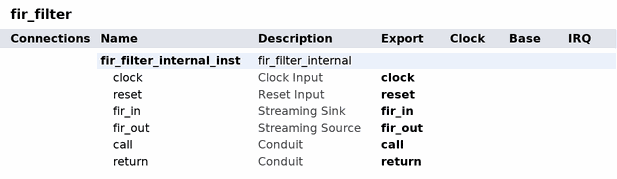
[diagram p0: system contents]
# Platform Designer (Qsys) system fir_filter, MAX 10 10M50DAF672I7G
# Parameters at their usual value, and those the tool derives, are not listed.
package require qsys
create_system fir_filter
set_project_property DEVICE_FAMILY {MAX 10}
set_project_property DEVICE 10M50DAF672I7G

add_instance fir_filter_internal_inst fir_filter_internal 1.0
set_instance_property fir_filter_internal_inst AUTO_EXPORT true

# exported interfaces
add_interface call conduit end
set_interface_property call EXPORT_OF fir_filter_internal_inst.call
add_interface clock clock sink
set_interface_property clock EXPORT_OF fir_filter_internal_inst.clock
add_interface fir_in avalon_streaming sink
set_interface_property fir_in EXPORT_OF fir_filter_internal_inst.fir_in
add_interface fir_out avalon_streaming source
set_interface_property fir_out EXPORT_OF fir_filter_internal_inst.fir_out
add_interface reset reset sink
set_interface_property reset EXPORT_OF fir_filter_internal_inst.reset
add_interface return conduit end
set_interface_property return EXPORT_OF fir_filter_internal_inst.return

set_interconnect_requirement {$system} qsys_mm.clockCrossingAdapter HANDSHAKE
set_interconnect_requirement {$system} qsys_mm.enableEccProtection FALSE
set_interconnect_requirement {$system} qsys_mm.insertDefaultSlave FALSE
set_interconnect_requirement {$system} qsys_mm.maxAdditionalLatency 1

save_system fir_filter.qsys
